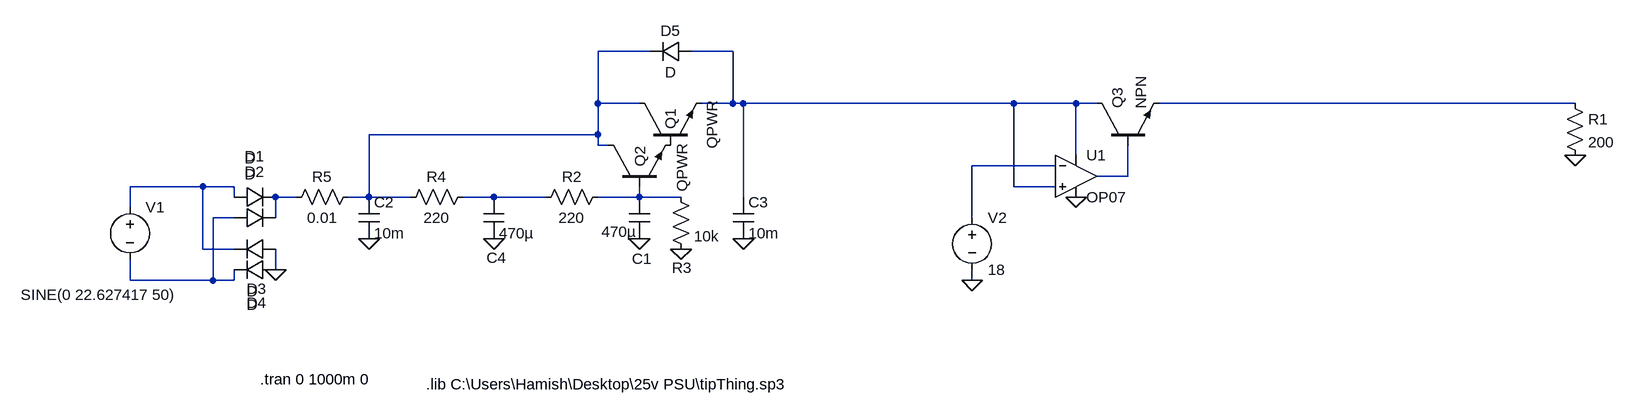
[diagram p0: schematic SpicePSU.asc]
SpicePSU.asc, the LTspice schematic file:
Version 4
SHEET 1 1812 680
WIRE 320 -144 240 -144
WIRE 448 -144 384 -144
WIRE 240 -64 240 -144
WIRE 304 -64 240 -64
WIRE 448 -64 448 -144
WIRE 448 -64 400 -64
WIRE 464 -64 448 -64
WIRE 880 -64 464 -64
WIRE 976 -64 880 -64
WIRE 1008 -64 976 -64
WIRE 1744 -64 1104 -64
WIRE 240 -16 240 -64
WIRE 240 -16 -112 -16
WIRE 240 0 240 -16
WIRE 256 0 240 0
WIRE 976 16 976 -64
WIRE 944 32 816 32
WIRE 1056 48 1056 0
WIRE 1056 48 1008 48
WIRE -368 64 -480 64
WIRE -320 64 -368 64
WIRE 880 64 880 -64
WIRE 944 64 880 64
WIRE -320 80 -320 64
WIRE -224 80 -256 80
WIRE -112 80 -112 -16
WIRE -112 80 -144 80
WIRE -48 80 -112 80
WIRE 80 80 32 80
WIRE 160 80 80 80
WIRE 304 80 304 64
WIRE 304 80 240 80
WIRE 368 80 304 80
WIRE 464 80 464 -64
WIRE -480 96 -480 64
WIRE -320 112 -352 112
WIRE -256 112 -256 80
WIRE 816 112 816 32
WIRE -368 160 -368 64
WIRE -320 160 -368 160
WIRE -256 192 -256 160
WIRE -480 208 -480 176
WIRE -352 208 -352 112
WIRE -352 208 -480 208
WIRE -320 208 -320 192
WIRE -320 208 -352 208
WIRE 816 208 816 192
FLAG -256 192 0
FLAG 368 160 0
FLAG 464 144 0
FLAG 304 144 0
FLAG 1744 16 0
FLAG 80 144 0
FLAG -112 144 0
FLAG 976 80 0
FLAG 816 208 0
SYMBOL voltage -480 80 R0
WINDOW 3 -168 150 Left 2
WINDOW 123 0 0 Left 0
WINDOW 39 0 0 Left 0
SYMATTR Value SINE(0 22.627417 50)
SYMATTR InstName V1
SYMBOL diode -320 128 R270
WINDOW 0 71 32 VTop 2
WINDOW 3 123 25 VBottom 2
SYMATTR InstName D2
SYMBOL diode -256 144 R90
WINDOW 0 93 29 VBottom 2
WINDOW 3 65 36 VTop 2
SYMATTR InstName D3
SYMBOL diode -256 176 R90
WINDOW 0 82 29 VBottom 2
WINDOW 3 54 36 VTop 2
SYMATTR InstName D4
SYMBOL diode 384 -160 R90
WINDOW 0 0 32 VBottom 2
WINDOW 3 32 32 VTop 2
SYMATTR InstName D5
SYMBOL res 352 64 R0
WINDOW 0 2 125 Left 2
SYMATTR InstName R3
SYMATTR Value 10k
SYMBOL cap 448 80 R0
SYMATTR InstName C3
SYMATTR Value 10m
SYMBOL diode -320 96 R270
WINDOW 0 63 32 VTop 2
WINDOW 3 67 25 VBottom 2
SYMATTR InstName D1
SYMBOL res 48 64 R90
WINDOW 0 0 56 VBottom 2
WINDOW 3 32 56 VTop 2
SYMATTR InstName R4
SYMATTR Value 220
SYMBOL cap 288 80 R0
WINDOW 0 5 95 Left 2
WINDOW 3 -42 53 Left 2
SYMATTR InstName C1
SYMATTR Value 470µ
SYMBOL cap 64 80 R0
WINDOW 0 5 93 Left 2
SYMATTR InstName C4
SYMATTR Value 470µ
SYMBOL res 256 64 R90
WINDOW 0 0 56 VBottom 2
WINDOW 3 32 56 VTop 2
SYMATTR InstName R2
SYMATTR Value 220
SYMBOL npn 304 0 R270
WINDOW 0 24 48 Left 2
WINDOW 3 -6 112 Left 2
SYMATTR InstName Q1
SYMATTR Value QPWR
SYMBOL npn 256 64 R270
WINDOW 0 30 49 Left 2
WINDOW 3 -8 114 Left 2
SYMATTR InstName Q2
SYMATTR Value QPWR
SYMBOL res -128 64 R90
WINDOW 0 0 56 VBottom 2
WINDOW 3 32 56 VTop 2
SYMATTR InstName R5
SYMATTR Value 0.01
SYMBOL cap -128 80 R0
SYMATTR InstName C2
SYMATTR Value 10m
SYMBOL Opamps\\OP07 976 -16 R0
SYMATTR InstName U1
SYMBOL voltage 816 96 R0
WINDOW 123 0 0 Left 0
WINDOW 39 0 0 Left 0
SYMATTR InstName V2
SYMATTR Value 18
SYMBOL npn 1008 0 R270
SYMATTR InstName Q3
SYMBOL res 1728 -80 R0
SYMATTR InstName R1
SYMATTR Value 200
TEXT -280 360 Left 2 !.tran 0 1000m 0
TEXT -24 368 Left 2 !.lib C:\\Users\\Hamish\\Desktop\\25v PSU\\tipThing.sp3

The netlist it stands for:
* SpicePSU.asc
V1 N006 N010 SINE(0 22.627417 50)
D2 N010 N007 D
D3 0 N006 D
D4 0 N010 D
D5 N002 N001 D
R3 N009 0 10k
C3 N002 0 10m
D1 N006 N007 D
R4 N008 N001 220
C1 N009 0 470µ
C4 N008 0 470µ
R2 N009 N008 220
Q1 N001 P001 N002 0 QPWR
Q2 N001 N009 P001 0 QPWR
R5 N001 N007 0.01
C2 N001 0 10m
XU1 N002 N004 N002 0 N005 LT1001  ; OP07, pins In+ In- V+ V- OUT
V2 N004 0 18
Q3 N002 N005 N003 0 NPN
R1 N003 0 200
.model D D
.lib standard.dio
.model NPN NPN
.model PNP PNP
.lib standard.bjt
.tran 0 1000m 0
.lib C:\Users\Hamish\Desktop\25v PSU\tipThing.sp3
.lib LTC.lib
.backanno
.end